# EAGLE board uSlices_v3.1 (EAGLE 9.3.1)
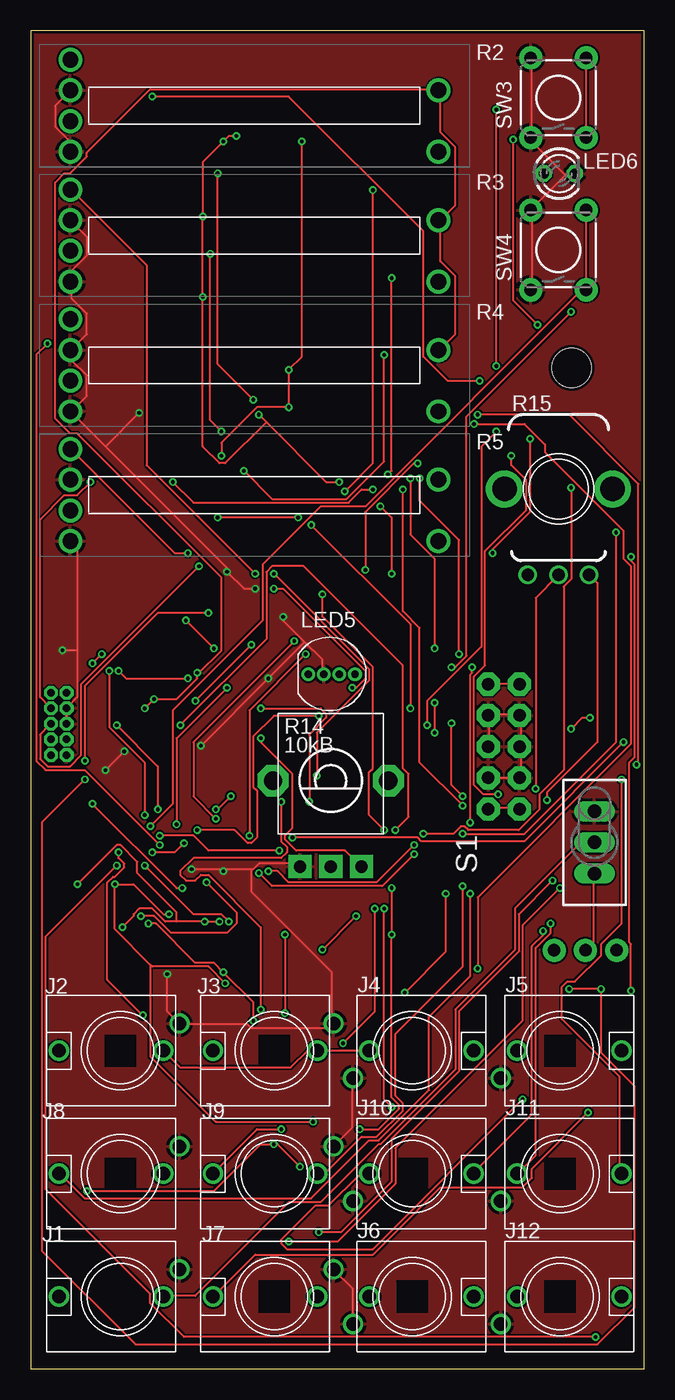
[diagram p3: board, top side]
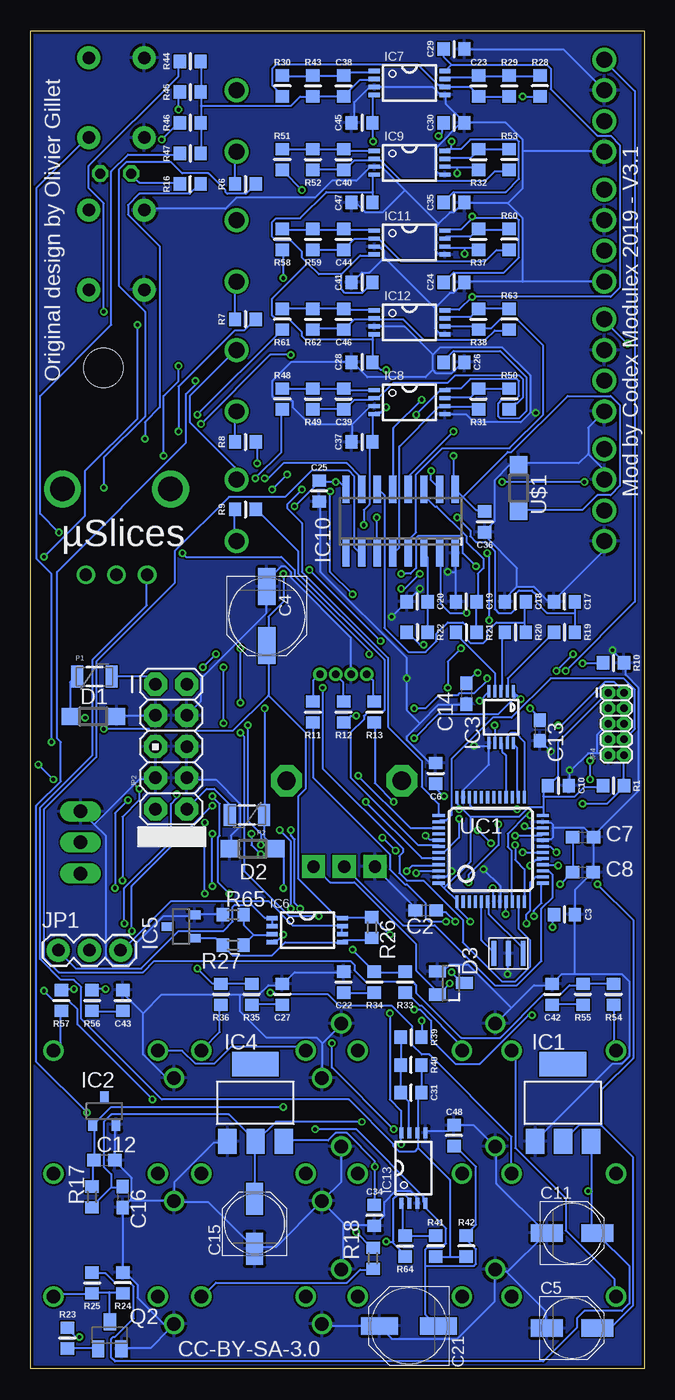
[diagram p4: board, bottom side, seen from below]

Size 50 x 109 mm. Coordinates in mm from the lower left corner, seen from the top.
Outline: 0,0 50,0 50,109 0,109 0,0
Copper layers (1*16): Top 0.035mm / dielectric 1.5mm / Bottom 0.035mm
Design rules "dirt_cheap_dirty_boards.v1.1": minimum track width 6mil, minimum drill 12mil, track to track 6mil, track to pad 6mil, pad to pad 6mil, via to via 6mil, smd to smd 0mil, copper to edge 10mil, drill to drill 10mil, minimum pad ring 10mil, minimum via ring 6mil, stop-mask expansion 2mil, vias tented up to drill 25mil, thermal gap 10mil
Holes 3.2 mm at 44.07,81.53

## Footprints (pad centres in the part's own frame; a part is rotated, then mirrored left to right if it is on the bottom)
C0603 = smd 1.1 x 1: 1 -0.85,0; 2 0.85,0
PARTS_AMAN_RESISTOR_0603 = smd 1 x 1.1: 1 -0.85,0; 2 0.85,0
PANASONIC_D = smd 3 x 1.4: + 2.4,0; - -2.4,0
PANASONIC_C = smd 2.6 x 1.4: + 2.05,0; - -2.05,0
SOD123 = smd 1.4 x 1.4: A 1.9,0; C -1.9,0
SOT23 = smd 1 x 1.4: 1 -0.95,-1.1; 2 0.95,-1.1; 3 0,1.1
SOT223 = smd 1.499 x 2.007: 1 -2.261,-3.15; 2 0.025,-3.15; 3 2.311,-3.15 | smd 3.81 x 2.007: 4 0,3.15
DBZ_R-PDSO-G3 = smd 0.7 x 1: 1 -0.95,-1.1; 2 0.95,-1.1; 3 0,1.1
MSOP10 = smd 0.25 x 1: 1 -1,-2.113; 2 -0.5,-2.113; 3 0,-2.113; 4 0.5,-2.113; 5 1,-2.113; 6 1,2.113; 7 0.5,2.113; 8 0,2.113; 9 -0.5,2.113; 10 -1,2.113
TSSOP-8 = smd 0.9 x 0.35: 1 -2.875,0.975; 2 -2.875,0.325; 3 -2.875,-0.325; 4 -2.875,-0.975; 5 2.875,-0.975; 6 2.875,-0.325; 7 2.875,0.325; 8 2.875,0.975
SOIC16N = smd 0.6 x 2.2: 1 -4.445,-2.6; 2 -3.175,-2.6; 3 -1.905,-2.6; 4 -0.635,-2.6; 5 0.635,-2.6; 6 1.905,-2.6; 7 3.175,-2.6; 8 4.445,-2.6; 9 4.445,2.6; 10 3.175,2.6; 11 1.905,2.6; 12 0.635,2.6; 13 -0.635,2.6; 14 -1.905,2.6; 15 -3.175,2.6; 16 -4.445,2.6
INSTRUO_S_JACK_S2_INV = drill 1.1: GND 2.223,-4.826; NORM 0,-3.5; TIP 0,5
1X03 = drill 1.016 pad 1.88: 1 0,0; 2 2.54,0; 3 5.08,0
AVR_ICSP = drill 1.016 pad 1.88 octagon: 1 -1.27,5.08; 2 1.27,5.08; 3 -1.27,2.54; 4 1.27,2.54; 5 -1.27,0; 6 1.27,0; 7 -1.27,-2.54; 8 1.27,-2.54; 9 -1.27,-5.08; 10 1.27,-5.08
2X5-1.27 = drill 0.61 pad 1.067 octagon: 1 -1.27,3.81; 2 0,3.81; 3 -1.27,2.54; 4 0,2.54; 5 -1.27,1.27; 6 0,1.27; 7 -1.27,0; 8 0,0; 9 -1.27,-1.27; 10 0,-1.27
LED-TRICOLOR-THROUGHHOLE = drill 0.6: BLU 0.635,0; GND -0.635,0; GRN 1.905,0; RED -1.905,0
LED3MM = drill 0.813 octagon: A -1.27,0; K 1.27,0
PTC-1206 = smd 1 x 1.8: 1 -1.4,0; 2 1.4,0
INSTRUO_CRYSTAL_SMALLER = smd 0.4 x 2: GND 0,0; X1 -1.2,0; X2 1.2,0
SOT23-BEC = smd 1 x 1.4: B -0.95,-1.1; C 0,1.1; E 0.95,-1.1
PTL2010G0103B2 = drill 1.3 pad 1.95: 1 2.5,3.75; 2 2.5,1.25; 3 2.5,-1.25; 4 2.5,-3.75; 5 32.5,-3.75; 6 32.5,1.25
ALPS_POT_VERTICAL_PS = drill 1 pad 1.88 square: P$1 -2.5,7; P$2 0,7; P$3 2.5,7 | drill 1.5 pad 2.54 octagon: P$4 -4.7,0; P$5 4.7,0
INSTRUO_Q-POT2 = drill 1 pad 1.5: P$1 -2.5,-7; P$2 0,-7; P$3 2.5,-7 | drill 2 pad 2.5: P$4 -4.4,0; P$5 4.4,0
R0603 = smd 1 x 1.1: 1 -0.85,0; 2 0.85,0
TL3XPO = drill 1.1 pad 1.422 long: 1 -2.54,0; 2 0,0; 3 2.54,0
SPARKFUN_TACTILE-PTH = drill 1.016 pad 1.88: 1 -3.251,2.261; 2 3.251,2.261; 3 -3.251,-2.261; 4 3.251,-2.261
LQFP48 = smd 0.254 x 1: 1 -2.75,-4.25; 2 -2.25,-4.25; 3 -1.75,-4.25; 4 -1.25,-4.25; 5 -0.75,-4.25; 6 -0.25,-4.25; 7 0.25,-4.25; 8 0.75,-4.25; 9 1.25,-4.25; 10 1.75,-4.25; 11 2.25,-4.25; 12 2.75,-4.25; 25 2.75,4.25; 26 2.25,4.25; 27 1.75,4.25; 28 1.25,4.25; 29 0.75,4.25; 30 0.25,4.25; 31 -0.25,4.25; 32 -0.75,4.25; 33 -1.25,4.25; 34 -1.75,4.25; 35 -2.25,4.25; 36 -2.75,4.25 | smd 1 x 0.254: 13 4.25,-2.75; 14 4.25,-2.25; 15 4.25,-1.75; 16 4.25,-1.25; 17 4.25,-0.75; 18 4.25,-0.25; 19 4.25,0.25; 20 4.25,0.75; 21 4.25,1.25; 22 4.25,1.75; 23 4.25,2.25; 24 4.25,2.75; 37 -4.25,2.75; 38 -4.25,2.25; 39 -4.25,1.75; 40 -4.25,1.25; 41 -4.25,0.75; 42 -4.25,0.25; 43 -4.25,-0.25; 44 -4.25,-0.75; 45 -4.25,-1.25; 46 -4.25,-1.75; 47 -4.25,-2.25; 48 -4.25,-2.75

## Placement (x,y rotation side)
C2  100n  [C0603]  17.8,37.34 180 bottom
C3  100n  [PARTS_AMAN_RESISTOR_0603]  6.5,37 0 bottom
C4  47u  [PANASONIC_D]  30.76,61.31 270 bottom
C5  22u  [PANASONIC_C]  5.89,3.32 0 bottom
C6  100n  [PARTS_AMAN_RESISTOR_0603]  17,48.5 90 bottom
C7  100n  [C0603]  5,43.31 0 bottom
C8  3.3u  [C0603]  5.01,40.45 0 bottom
C10  100n  [PARTS_AMAN_RESISTOR_0603]  7,47.5 0 bottom
C11  22u  [PANASONIC_C]  5.88,11.06 0 bottom
C12  470n  [C0603]  44,17 0 bottom
C13  100n  [C0603]  8.5,52 270 bottom
C14  3.3u  [C0603]  14.5,55 270 bottom
C15  22u  [PANASONIC_C]  31.75,11.81 90 bottom
C16  100n  [C0603]  42.5,14 270 bottom
C17  1u  [PARTS_AMAN_RESISTOR_0603]  6.5,62.5 180 bottom
C18  1u  [PARTS_AMAN_RESISTOR_0603]  10.5,62.5 180 bottom
C19  1u  [PARTS_AMAN_RESISTOR_0603]  14.5,62.5 180 bottom
C20  1u  [PARTS_AMAN_RESISTOR_0603]  18.5,62.5 180 bottom
C21  47u  [PANASONIC_D]  19.17,3.49 180 bottom
C22  560p  [PARTS_AMAN_RESISTOR_0603]  24.5,31.5 90 bottom
C23  18p  [PARTS_AMAN_RESISTOR_0603]  13.5,104.5 90 bottom
C24  100n  [PARTS_AMAN_RESISTOR_0603]  15.5,88.5 0 bottom
C25  100n  [PARTS_AMAN_RESISTOR_0603]  26.5,71.5 270 bottom
C26  100n  [PARTS_AMAN_RESISTOR_0603]  15.5,82 0 bottom
C27  560p  [PARTS_AMAN_RESISTOR_0603]  29.5,30.5 90 bottom
C28  100n  [PARTS_AMAN_RESISTOR_0603]  23,82 0 bottom
C29  100n  [PARTS_AMAN_RESISTOR_0603]  15.5,107.5 0 bottom
C30  100n  [PARTS_AMAN_RESISTOR_0603]  15.5,101.5 0 bottom
C31  560p  [PARTS_AMAN_RESISTOR_0603]  19,22.5 180 bottom
C34  100n  [PARTS_AMAN_RESISTOR_0603]  22,12.5 270 bottom
C35  100n  [PARTS_AMAN_RESISTOR_0603]  15.5,95 0 bottom
C36  100n  [PARTS_AMAN_RESISTOR_0603]  13,69 90 bottom
C37  100n  [PARTS_AMAN_RESISTOR_0603]  23,75.5 0 bottom
C38  18p  [PARTS_AMAN_RESISTOR_0603]  24.5,104.5 90 bottom
C39  18p  [PARTS_AMAN_RESISTOR_0603]  24.5,79 90 bottom
C40  18p  [PARTS_AMAN_RESISTOR_0603]  24.5,98.5 90 bottom
C41  100n  [PARTS_AMAN_RESISTOR_0603]  23,88.5 0 bottom
C42  560p  [PARTS_AMAN_RESISTOR_0603]  7.5,30.5 90 bottom
C43  560p  [PARTS_AMAN_RESISTOR_0603]  42.5,30 90 bottom
C44  18p  [PARTS_AMAN_RESISTOR_0603]  24.5,92 90 bottom
C45  100n  [PARTS_AMAN_RESISTOR_0603]  23,101.5 0 bottom
C46  18p  [PARTS_AMAN_RESISTOR_0603]  24.5,85.5 90 bottom
C47  100n  [PARTS_AMAN_RESISTOR_0603]  23,95 0 bottom
C48  100n  [PARTS_AMAN_RESISTOR_0603]  15.5,19 270 bottom
D1  1N5819HW  [SOD123]  44.89,53.14 0 bottom
D2  1N5819HW  [SOD123]  31.91,42.36 0 bottom
D3  BAT54S  [SOT23]  15.76,31.43 270 bottom
IC1  LM1117-3.3  [SOT223]  6.63,21.68 0 bottom
IC2  LM4040B25  [DBZ_R-PDSO-G3]  44,21 0 bottom
IC3  DAC124S085CIMT  [MSOP10]  11.67,53.09 180 bottom
IC4  LM1117-3.3  [SOT223]  31.7,21.68 0 bottom
IC5  LM4040B10  [DBZ_R-PDSO-G3]  37.74,36.02 90 bottom
IC6  TL072TSSOP  [TSSOP-8]  27.45,35.74 0 bottom
IC7  TL072TSSOP  [TSSOP-8]  19.13,104.74 0 bottom
IC8  TL072TSSOP  [TSSOP-8]  19.13,78.74 0 bottom
IC9  TL072TSSOP  [TSSOP-8]  19.13,98.24 0 bottom
IC10  V2164SZ  [SOIC16N]  19.86,69.04 0 bottom
IC11  TL072TSSOP  [TSSOP-8]  19.13,91.74 0 bottom
IC12  TL072TSSOP  [TSSOP-8]  19.13,85.24 0 bottom
IC13  TL072TSSOP  [TSSOP-8]  18.81,16.36 90 bottom
J1  [INSTRUO_S_JACK_S2_INV]  7.31,5.88 90 top
J2  [INSTRUO_S_JACK_S2_INV]  7.31,25.91 90 top
J3  [INSTRUO_S_JACK_S2_INV]  19.86,25.91 90 top
J4  [INSTRUO_S_JACK_S2_INV]  31.09,25.91 270 top
J5  [INSTRUO_S_JACK_S2_INV]  43.14,25.91 270 top
J6  [INSTRUO_S_JACK_S2_INV]  31.09,5.88 270 top
J7  [INSTRUO_S_JACK_S2_INV]  19.86,5.88 90 top
J8  [INSTRUO_S_JACK_S2_INV]  7.31,15.89 90 top
J9  [INSTRUO_S_JACK_S2_INV]  19.86,15.89 90 top
J10  [INSTRUO_S_JACK_S2_INV]  31.09,15.89 270 top
J11  [INSTRUO_S_JACK_S2_INV]  43.14,15.89 270 top
J12  [INSTRUO_S_JACK_S2_INV]  43.14,5.88 270 top
JP1  [1X03]  47.75,34.09 0 bottom
JP2  M05X2PTH  [AVR_ICSP]  38.56,50.68 0 bottom
JP4  M05X2MINIJTAG  [2X5-1.27]  1.66,51.27 0 bottom
LED5  WP154A4SUREQBFZG  [LED-TRICOLOR-THROUGHHOLE]  24.52,56.58 0 top
LED6  [LED3MM]  43.07,97.37 0 top
P1  PTCSMD  [PTC-1206]  44.8,56.39 0 bottom
P2  PTCSMD  [PTC-1206]  32.38,45.11 180 bottom
Q1  8MHz  [INSTRUO_CRYSTAL_SMALLER]  11.07,33.84 0 bottom
Q2  MMBT3904  [SOT23-BEC]  43.55,2.74 0 bottom
R1  10k  [PARTS_AMAN_RESISTOR_0603]  2.5,47.5 180 bottom
R2  PTL20-10G0-103B2  [PTL2010G0103B2]  0.74,102.89 0 top
R3  PTL20-10G0-103B2  [PTL2010G0103B2]  0.74,92.32 0 top
R4  PTL20-10G0-103B2  [PTL2010G0103B2]  0.74,81.74 0 top
R5  PTL20-10G0-103B2  [PTL2010G0103B2]  0.74,71.17 0 top
R6  100  [PARTS_AMAN_RESISTOR_0603]  32.5,96.5 0 bottom
R7  100  [PARTS_AMAN_RESISTOR_0603]  32.5,85.5 0 bottom
R8  100  [PARTS_AMAN_RESISTOR_0603]  32.5,75.5 0 bottom
R9  100  [PARTS_AMAN_RESISTOR_0603]  32.5,70 0 bottom
R10  10k  [PARTS_AMAN_RESISTOR_0603]  2.5,57.5 180 bottom
R11  100  [PARTS_AMAN_RESISTOR_0603]  27,53.5 90 bottom
R12  100  [PARTS_AMAN_RESISTOR_0603]  24.5,53.5 90 bottom
R13  100  [PARTS_AMAN_RESISTOR_0603]  22,53.5 90 bottom
R14  10kB  [ALPS_POT_VERTICAL_PS]  24.45,47.91 180 top
R15  10kB CD  [INSTRUO_Q-POT2]  43.01,71.67 0 top
R16  100  [PARTS_AMAN_RESISTOR_0603]  37,96.5 180 bottom
R17  510  [R0603]  45,14 90 bottom
R18  100k  [R0603]  22.1,9 90 bottom
R19  100  [PARTS_AMAN_RESISTOR_0603]  6.5,60 0 bottom
R20  100  [PARTS_AMAN_RESISTOR_0603]  10.5,60 0 bottom
R21  100  [PARTS_AMAN_RESISTOR_0603]  14.5,60 0 bottom
R22  100  [PARTS_AMAN_RESISTOR_0603]  18.5,60 0 bottom
R23  10k  [PARTS_AMAN_RESISTOR_0603]  47,2.5 270 bottom
R24  3.3k  [PARTS_AMAN_RESISTOR_0603]  42.5,7 270 bottom
R25  4.7k  [PARTS_AMAN_RESISTOR_0603]  45,7 90 bottom
R26  4.7k  [R0603]  22.19,35.95 270 bottom
R27  100k  [R0603]  33.5,34.5 180 bottom
R28  1k  [PARTS_AMAN_RESISTOR_0603]  8.5,104.5 270 bottom
R29  100k  [PARTS_AMAN_RESISTOR_0603]  11,104.5 90 bottom
R30  100k  [PARTS_AMAN_RESISTOR_0603]  29.5,104.5 270 bottom
R31  100k  [PARTS_AMAN_RESISTOR_0603]  13.5,79 90 bottom
R32  100k  [PARTS_AMAN_RESISTOR_0603]  13.5,98.5 90 bottom
R33  100k  [PARTS_AMAN_RESISTOR_0603]  19.5,31.5 90 bottom
R34  510  [PARTS_AMAN_RESISTOR_0603]  22,31.5 90 bottom
R35  510  [PARTS_AMAN_RESISTOR_0603]  32,30.5 90 bottom
R36  100k  [PARTS_AMAN_RESISTOR_0603]  34.5,30.5 90 bottom
R37  100k  [PARTS_AMAN_RESISTOR_0603]  13.5,92 90 bottom
R38  100k  [PARTS_AMAN_RESISTOR_0603]  13.5,85.5 90 bottom
R39  1k  [PARTS_AMAN_RESISTOR_0603]  19,27 0 bottom
R40  33k  [PARTS_AMAN_RESISTOR_0603]  19,24.75 180 bottom
R41  100k  [PARTS_AMAN_RESISTOR_0603]  17,10 270 bottom
R42  240k  [PARTS_AMAN_RESISTOR_0603]  14.5,10 270 bottom
R43  49.9k  [PARTS_AMAN_RESISTOR_0603]  27,104.5 90 bottom
R44  100k  [PARTS_AMAN_RESISTOR_0603]  37,106.5 0 bottom
R45  100k  [PARTS_AMAN_RESISTOR_0603]  37,104 0 bottom
R46  100k  [PARTS_AMAN_RESISTOR_0603]  37,101.5 0 bottom
R47  100k  [PARTS_AMAN_RESISTOR_0603]  37,99 0 bottom
R48  1k  [PARTS_AMAN_RESISTOR_0603]  29.5,79 270 bottom
R49  100k  [PARTS_AMAN_RESISTOR_0603]  27,79 90 bottom
R50  100k  [PARTS_AMAN_RESISTOR_0603]  11,79 270 bottom
R51  1k  [PARTS_AMAN_RESISTOR_0603]  29.5,98.5 270 bottom
R52  100k  [PARTS_AMAN_RESISTOR_0603]  27,98.5 90 bottom
R53  100k  [PARTS_AMAN_RESISTOR_0603]  11,98.5 270 bottom
R54  100k  [PARTS_AMAN_RESISTOR_0603]  2.5,30.5 90 bottom
R55  510  [PARTS_AMAN_RESISTOR_0603]  5,30.5 90 bottom
R56  510  [PARTS_AMAN_RESISTOR_0603]  45,30 90 bottom
R57  100k  [PARTS_AMAN_RESISTOR_0603]  47.5,30 90 bottom
R58  1k  [PARTS_AMAN_RESISTOR_0603]  29.5,92 270 bottom
R59  100k  [PARTS_AMAN_RESISTOR_0603]  27,92 90 bottom
R60  100k  [PARTS_AMAN_RESISTOR_0603]  11,92 270 bottom
R61  1k  [PARTS_AMAN_RESISTOR_0603]  29.5,85.5 270 bottom
R62  100k  [PARTS_AMAN_RESISTOR_0603]  27,85.5 90 bottom
R63  100k  [PARTS_AMAN_RESISTOR_0603]  11,85.5 270 bottom
R64  100k  [PARTS_AMAN_RESISTOR_0603]  19.5,10 90 bottom
R65  100k  [R0603]  33.5,37 0 bottom
S1  TL32PO  [TL3XPO]  45.94,42.88 270 top
SW3  [SPARKFUN_TACTILE-PTH]  43.01,103.54 90 top
SW4  [SPARKFUN_TACTILE-PTH]  43.01,91.14 90 top
U$1  1N5819HW  [SOD123]  10.25,71.75 270 bottom
UC1  STM32F103CBT6  [LQFP48]  12.51,42.31 0 bottom

## Tracks (layer width: path | path; a pad name or v marks a point on that pad's centre or on a via)
+3V3  (via drill 0.3)
  Top 0.152: v7.47,35.97 8.38,36.88 8.38,37.03 8.84,37.49 9.91,37.49 10.97,36.42 11.89,36.42 | 11.89,36.42 v14.17,36.42 v15.39,36.42 | v16.31,46.63 15.24,45.57 v15.09,45.57 | v3.81,39.47 7.01,42.67 7.32,42.67 8.69,41.3 8.69,40.39 11.89,37.19 11.89,36.42
  Bottom 0.152: 3.5,19.81 5.33,19.81 6.55,18.59 IC1.2 | 3.5,19.81 0.91,17.22 0.91,5.18 2.74,3.35 3.81,3.35 C5.+ | 16.31,39.17 16.61,39.47 UC1.48 | 16.31,39.17 15.24,38.1 UC1.1 15.24,37.95 15.24,37.49 v14.17,36.42 | v7.47,35.97 7.47,36.88 C3.1 | v15.39,36.42 16.15,37.19 16.92,37.19 C2.1 | 8.23,46.63 8.23,47.09 7.92,47.4 C10.1 7.77,47.55 7.01,48.31 7.01,51.05 3.05,55.02 JP4.1 | 8.23,46.63 8.23,45.72 | 8.23,45.72 8.23,45.11 UC1.24 | 14.17,44.96 14.94,45.72 | 14.94,45.72 15.24,46.02 15.24,46.48 UC1.36 | 14.17,44.96 10.21,44.96 9.45,45.72 8.23,45.72 | 8.23,46.63 5.64,46.63 4.88,47.4 3.35,47.4 R1.2 | v16.31,46.63 16.92,47.24 16.92,47.55 C6.1 | 14.94,45.72 v15.09,45.57 | 16.31,39.17 14.17,41.3 14.17,44.96 | 3.5,19.81 3.5,22.71 0.91,25.3 0.91,36.58 v3.81,39.47
+3V3_A  (via drill 0.3)
  Top 0.152: R4.6 33.38,83.06 34.59,84.28 34.59,89 33.38,90.22 33.38,93.42 R3.6 33.38,93.57 34.59,94.79 34.59,99.52 33.38,100.74 33.38,104.09 R2.6 33.22,104.24 9.75,104.24 4.57,99.06 4.57,98.75 3.2,97.38 2.74,97.38 1.98,96.62 1.98,77.42 3.2,76.2 3.81,76.2 15.54,64.47 15.54,58.52 13.56,56.54 | v11.28,37.03 10.82,37.03 8.38,39.47 v6.86,39.47 6.86,35.81 9.75,32.92 | v9.3,53.8 v10.06,54.56 11.89,54.56 13.56,56.24 13.56,56.54 | v18.75,51.36 18.75,51.05 21.34,48.46 21.34,44.04 20.73,43.43 20.73,43.13 21.64,42.22 25.6,42.22 26.82,41 R14.P$1 | 9.75,32.92 9.91,32.77 14.48,32.77 v15.85,31.39 | v23.01,20.12 15.09,20.12 9.75,25.45 9.75,32.92 | 13.56,56.54 v13.56,56.69
  Bottom 0.152: R5.6 33.38,72.54 33.38,73.46 37.03,77.11 37.03,79.25 33.38,82.91 R4.6 | 43.43,14.78 42.52,14.78 C16.1 | 43.43,14.78 44.96,13.26 R17.1 | IC4.2 31.7,18.44 31.7,13.87 C15.+ | 43.43,14.78 43.43,15.85 44.04,16.46 44.04,20.12 43.43,20.73 33.83,20.73 31.7,18.59 IC4.2 | v11.28,37.03 11.28,37.95 UC1.9 | v6.86,39.47 5.94,40.39 C8.1 5.79,40.54 5.79,43.28 C7.1 | v10.06,54.56 10.36,54.86 | 10.36,54.86 10.67,55.17 IC3.1 | v9.3,53.8 8.38,52.88 C13.1 | v13.56,56.69 13.72,56.69 14.48,55.93 C14.1 | R14.P$1 26.82,40.84 25.6,39.62 23.62,39.62 18.59,34.59 18.59,32.46 16.92,30.79 16.92,30.48 D3.2 16.76,30.48 v15.85,31.39 | 10.36,54.86 11.89,53.34 16.76,53.34 v18.75,51.36 | v23.01,20.12 30.02,20.12 31.55,18.59 IC4.2
ADD_SWITCH  (via drill 0.3)
  Top 0.152: v10.52,43.43 13.26,43.43 14.48,42.22 v20.27,42.22 | v21.34,43.28 31.55,43.28 31.85,42.98 40.23,42.98 v48.31,51.05 | SW3.4 45.26,106.68 45.26,100.43 SW3.3
  Bottom 0.152: v10.52,43.43 8.38,43.43 UC1.21 | v21.34,43.28 v20.27,42.22 | v48.31,51.05 48.31,64.77 49.53,65.99 49.53,96.16 45.41,100.28 SW3.3
AREF_2.5  (via drill 0.3)
  Top 0.152: v12.19,52.43 19.2,59.44 19.2,64.92 19.66,65.38 22.25,65.38 30.33,57.3 30.33,48.92 30.79,48.46 30.79,44.96 v29.72,43.89 | v28.8,37.49 28.8,21.95 v29.41,21.34
  Bottom 0.152: R17.2 44.96,14.94 44.96,16.92 C12.1 44.81,17.07 44.81,19.81 IC2.1 44.81,19.96 43.43,21.34 v29.41,21.34 | v12.19,52.43 12.19,51.05 IC3.7 | v29.72,43.89 28.8,42.98 v28.8,37.49
AREF_5
  Bottom 0.152: IC6.2 30.33,36.12 30.33,36.58 IC6.1 30.94,36.73 32,37.8 33.38,37.8 33.53,37.64 33.53,36.42 34.29,35.66 37.95,35.66 41,32.61 46.33,32.61 47.7,33.98 JP1.1
AREF_10
  Bottom 0.152: IC6.6 24.69,35.51 24.69,35.97 IC6.7 24.69,36.12 28.65,36.12 30.63,38.1 38.56,38.1 42.52,34.14 JP1.3
AREF_10_0
  Bottom 0.152: R26.2 22.25,35.05 22.4,34.9 24.54,34.9 IC6.5 24.69,34.75 29.26,34.75 30.33,33.68 33.53,33.68 34.29,34.44 R27.2 34.44,34.59 34.9,35.05 36.58,35.05 IC5.1
BOOT_FLASH  (via drill 0.3)
  Top 0.152: v22.71,46.18 22.71,51.66 24.08,53.03 24.08,53.34 23.62,53.8 v18.75,53.8 | v12.8,56.24 7.77,56.24 v7.16,56.84 | v5.03,57.45 v5.79,58.22
  Bottom 0.152: v22.71,46.18 18.14,41.6 16.76,41.6 UC1.44 | v18.75,53.8 17.83,53.8 16.76,54.86 15.24,54.86 15.09,55.02 13.87,55.02 12.8,56.08 v12.8,56.24 | v5.79,58.22 v7.16,56.84 | v5.03,57.45 3.35,57.45 R10.2
DAC_MOSI
  Bottom 0.152: UC1.28 11.28,46.63 11.28,49.99 11.58,50.29 11.58,50.9 IC3.8
DAC_SCK
  Bottom 0.152: UC1.26 10.36,46.63 10.36,50.6 10.67,50.9 IC3.10
DAC_SS
  Bottom 0.152: UC1.25 9.75,46.63 9.75,51.05 10.52,51.82 10.82,51.82 11.12,51.51 11.12,51.05 IC3.9
DEL_SWITCH  (via drill 0.3)
  Top 0.152: v9.75,44.2 11.58,46.02 11.58,53.65 18.9,60.96 18.9,65.53 23.62,70.26 27.28,70.26 44.81,87.78 45.26,87.78 SW4.3 45.26,87.94 45.26,94.34 SW4.4
  Bottom 0.152: v9.75,44.2 9.6,44.04 8.38,44.04 UC1.22
FB_CURRENT
  Bottom 0.152: R54.2 2.59,31.39 4.88,31.39 R55.2 5.03,31.24 6.1,31.24 6.86,30.48 8.23,30.48 11.73,26.98 14.94,26.98 18.59,30.63 18.59,31.24 18.9,31.55 22.71,31.55 23.62,32.46 23.62,32.92 23.93,33.22 39.93,33.22 40.84,32.31 47.7,32.31 48.92,33.53 48.92,45.57 44.65,49.84 44.65,57.61 38.25,64.01 38.25,66.6 33.83,71.02 29.26,71.02 27.13,73.15 24.08,73.15 23.62,72.69 23.62,66.9 23.16,66.45 IC10.2
FB_CURRENT1  (via drill 0.3)
  Top 0.152: v26.52,36.88 v23.77,34.14 | v32.92,54.25 v32.92,51.82 | v32.92,58.67 32.92,65.99 30.94,67.97 v30.94,72.54
  Bottom 0.152: R33.2 19.51,32.31 21.95,32.31 R34.2 22.1,32.46 v23.77,34.14 | v26.52,36.88 28.96,36.88 32.61,40.54 32.61,51.51 v32.92,51.82 | v32.92,58.67 v32.92,54.25 | v30.94,72.54 30.63,72.54 29.41,73.76 24.23,73.76 23.16,72.69 23.16,71.78 IC10.15
FB_CURRENT2  (via drill 0.3)
  Top 0.152: v36.42,32.61 36.42,38.41 48.92,50.9 48.92,65.38 48.31,65.99 48.31,68.28 41.91,74.68 41.91,75.29 40.23,76.96 v36.12,76.96 | v28.8,82.6 28.8,73.91 25.76,70.87 19.66,70.87 v17.37,73.15
  Bottom 0.152: R35.2 32,31.39 34.44,31.39 R36.2 34.59,31.39 35.2,31.39 v36.42,32.61 | v36.12,76.96 30.48,82.6 v28.8,82.6 | v17.37,73.15 17.37,72.39 16.76,71.78 IC10.10
FB_CURRENT3  (via drill 0.3)
  Top 0.152: v43.89,30.94 v46.48,30.94 46.48,25.76 49.23,23.01 49.23,5.03 46.18,1.98 8.53,1.98 0.91,9.6 0.91,44.5 v4.42,48.01 | v4.42,49.53 4.42,55.63 10.36,61.57 v14.48,61.57
  Bottom 0.152: v43.89,30.94 44.96,30.94 R56.2 | v46.48,30.94 47.4,30.94 R57.2 | v4.42,49.53 v4.42,48.01 | v14.48,61.57 15.85,61.57 16.61,62.33 16.61,66.29 IC10.7
FRAME_CHANGE  (via drill 0.3)
  Top 0.152: v7.01,41 1.22,35.2 1.22,14.63 9.75,6.1 9.75,5.33 12.5,2.59 v46.02,2.59
  Bottom 0.152: v7.01,41 8.23,41 UC1.16 | v46.02,2.59 46.33,2.59 46.94,3.2 R23.1
GAIN_1  (via drill 0.3)
  Top 0.152: v21.79,69.34 v15.24,69.34
  Bottom 0.152: 5.64,61.57 5.64,62.48 C17.1 | 5.64,61.57 5.64,60.05 R19.2 | 5.64,61.57 7.92,61.57 8.84,62.48 8.84,63.09 9.14,63.4 10.21,63.4 10.52,63.09 10.52,61.87 10.82,61.57 11.89,61.57 12.19,61.87 12.19,66.6 12.95,67.36 13.72,67.36 14.17,67.82 14.17,68.28 v15.24,69.34 | v21.79,69.34 21.79,66.45 IC10.3
GAIN_2
  Bottom 0.152: 9.75,60.81 9.75,62.48 C18.1 | 9.75,60.81 9.75,60.05 R20.2 | 9.75,60.81 12.04,60.81 12.8,60.05 12.8,59.44 13.11,59.13 14.17,59.13 14.48,59.44 14.48,60.5 14.78,60.81 16,60.81 16.92,59.89 16.92,59.28 17.83,58.37 19.2,58.37 21.18,60.35 21.18,71.17 21.64,71.63 IC10.14
GAIN_3
  Bottom 0.152: R21.2 13.72,60.05 13.72,62.48 C19.1 13.56,62.64 13.56,64.77 13.11,65.23 13.11,65.99 14.48,67.36 14.48,67.82 16.92,70.26 17.07,70.26 17.83,71.02 17.83,71.63 IC10.11
GAIN_4
  Bottom 0.152: R22.2 17.68,60.05 17.68,62.48 C20.1 17.68,62.64 17.68,66.14 17.83,66.29 IC10.6
GND  (via drill 0.3)
  Top 0.152: v11.12,32.16 11.12,29.11 12.04,28.19 J2.GND 12.19,28.04 17.68,28.04 17.98,27.74 24.23,27.74 24.54,28.04 J3.GND 24.54,28.19 24.54,32.31 17.98,38.86 17.98,40.69 | 17.98,40.69 18.14,40.69 18.59,41.15 21.79,41.15 21.95,41 R14.P$3 | 17.98,40.69 15.7,40.69 | 15.7,40.69 v13.11,40.69 | 15.7,40.69 v15.7,40.54 | J6.GND 26.21,3.66 26.21,6.55 24.69,8.08 J7.GND | J4.GND 26.21,23.62 26.21,19.66 24.69,18.14 J9.GND | v20.57,61.27 20.57,60.96 22.25,59.28 | 22.25,59.28 23.77,57.76 23.77,56.69 LED5.GND | v13.87,50.75 v19.36,56.24 22.25,59.13 22.25,59.28 | JP2.8 37.34,48.16 39.78,48.16 JP2.7 39.93,48.16 39.93,50.6 JP2.5 39.93,50.75 39.93,53.19 JP2.3 39.78,53.34 37.34,53.34 JP2.4 37.34,53.19 37.34,50.75 JP2.6 | JP4.5 2.9,52.58 2.9,53.8 JP4.3 3.05,53.95 3.81,54.71 3.81,58.52 | v6.1,48.77 v7.62,50.29 | 3.81,58.52 3.81,66.9 3.35,67.36 R5.4 | 43.59,97.23 44.2,97.23 LED6.K | 43.59,97.23 40.84,94.49 SW4.2 40.84,94.34 40.84,87.94 SW4.1 | 43.59,97.23 40.84,99.97 40.84,100.28 SW3.1 40.84,100.43 40.84,106.68 SW3.2 | R2.4 3.2,99.21 3.2,99.97 1.98,101.19 1.98,102.87 3.2,104.09 R2.2 | R3.2 3.35,93.42 4.57,92.2 4.57,90.68 3.35,89.46 3.35,88.7 R3.4 3.35,88.54 3.35,87.17 4.57,85.95 4.57,84.28 3.35,83.06 R4.2 3.35,82.91 3.35,82.14 4.57,80.92 4.57,79.25 3.35,78.03 R4.4 3.35,77.88 6.1,75.13 | 6.1,75.13 16,65.23 v16,64.92 17.37,63.55 v18.29,63.55 | 6.1,75.13 v8.84,77.88 | 3.81,58.52 v2.59,58.52
  Bottom 0.152: 7.47,44.04 7.47,44.35 7.62,44.5 8.23,44.5 UC1.23 | 7.47,44.04 7.47,43.28 7.62,43.13 8.23,43.13 UC1.20 | C7.2 4.12,43.28 4.12,40.54 C8.2 4.27,40.39 5.64,39.01 5.64,37.03 C3.2 5.64,36.88 5.64,32.16 | C7.2 4.12,43.43 0.46,47.09 0.46,55.47 1.52,56.54 1.52,57.45 R10.1 1.68,57.61 v2.59,58.52 | 7.47,44.04 4.88,44.04 4.27,43.43 C7.2 | 10.82,29.41 12.04,28.19 J2.GND | 10.82,29.41 8.99,31.24 7.62,31.24 C42.2 7.47,31.39 6.71,32.16 5.64,32.16 | 10.82,29.41 14.33,32.92 15.85,32.92 16.31,32.46 16.76,32.46 D3.1 | v11.12,32.16 11.12,33.83 Q1.GND | 5.64,32.16 1.83,32.16 1.22,31.55 1.22,25.45 1.83,24.84 2.59,24.84 8.84,18.59 IC1.1 | IC13.5 17.83,19.36 16,19.36 15.54,19.81 C48.1 15.39,19.81 13.87,19.81 12.19,18.14 J8.GND 12.04,17.98 12.04,15.09 8.08,11.12 C11.- 8.08,10.97 11.12,7.92 11.28,7.92 | 11.28,7.92 11.43,8.08 12.04,8.08 J1.GND 12.19,8.08 12.19,5.49 15.24,2.44 20.57,2.44 21.49,3.35 C21.+ 21.64,3.5 26.21,3.5 J6.GND | 11.28,7.92 8.08,4.72 8.08,3.35 C5.- | C22.2 24.54,32.31 28.5,32.31 29.41,31.39 C27.2 29.57,31.24 30.63,31.24 31.39,30.48 32.92,30.48 | 40.84,28.96 42.37,30.48 42.37,30.79 C43.2 | 40.84,28.96 40.84,25.6 39.01,23.77 38.41,23.77 J5.GND | 32.92,30.48 39.32,30.48 40.84,28.96 | IC4.1 33.98,18.44 35.05,18.44 38.25,15.24 38.25,13.72 J11.GND | 38.71,3.2 38.41,3.5 J12.GND 38.71,3.2 | 38.71,3.2 40.23,1.68 42.52,1.68 Q2.E | IC2.2 43.13,19.81 43.13,17.07 C12.2 43.13,16.92 41.76,15.54 41.76,13.87 41.91,13.72 | 41.91,13.72 42.37,13.26 C16.2 42.52,13.11 42.52,7.92 R24.1 42.37,7.92 41.3,6.86 41.3,5.79 38.71,3.2 | 41.91,13.72 38.41,13.72 J11.GND | v13.11,40.69 11.73,39.32 11.73,38.1 UC1.8
  Bottom 0.152: v15.7,40.54 16.15,40.08 16.61,40.08 UC1.47 | C2.2 18.75,37.34 18.75,37.64 21.95,40.84 R14.P$3 | 26.21,26.52 24.69,28.04 J3.GND | 26.21,26.52 26.21,23.77 J4.GND | IC13.3 18.59,13.56 18.59,14.02 19.05,14.48 20.27,14.48 21.18,13.56 21.18,12.5 21.95,11.73 C34.2 22.1,11.73 24.38,11.73 24.54,11.89 | J10.GND 26.36,13.56 30.02,9.91 31.7,9.91 C15.- 31.85,9.91 35.51,13.56 38.25,13.56 J11.GND | 24.54,11.89 26.21,13.56 J10.GND | 24.54,11.89 24.54,8.23 J7.GND | J9.GND 24.69,17.98 24.69,15.24 26.21,13.72 J10.GND | 32.92,30.48 32.92,29.11 30.79,26.98 26.67,26.98 26.21,26.52 | 18.29,52.58 19.36,51.51 19.36,51.21 17.53,49.38 17.07,49.38 C6.2 | 18.29,52.58 16.76,54.1 14.63,54.1 C14.2 | 18.29,52.58 19.36,53.65 v19.36,56.24 19.36,57.91 26.36,64.92 26.36,70.56 C25.2 | 12.65,50.75 12.65,49.23 14.78,47.09 14.78,46.63 UC1.35 | 12.65,50.75 12.65,50.9 IC3.6 12.65,50.75 | v20.57,61.27 19.36,62.48 C20.2 19.2,62.64 v18.29,63.55 | v13.87,50.75 12.65,50.75 | R65.1 34.44,37.03 36.58,37.03 IC5.2 36.73,36.88 39.17,36.88 41.45,34.59 41.45,33.53 42.06,32.92 43.28,32.92 43.89,33.53 43.89,43.43 44.81,44.35 | 44.81,44.35 45.87,45.41 S1.1 | D2.C 33.68,42.37 33.68,43.43 32.92,44.2 32.92,46.02 34.9,48.01 37.19,48.01 JP2.8 | D1.A 42.98,53.19 39.93,53.19 JP2.3 | JP2.4 37.19,53.34 36.12,54.41 36.12,56.24 30.79,61.57 30.79,63.7 C4.- 30.63,63.86 30.63,64.31 29.57,65.38 29.26,65.38 28.8,64.92 28.8,64.47 23.93,59.59 23.93,56.69 LED5.GND | 44.81,44.35 41.15,48.01 39.93,48.01 JP2.7 | 5.94,48.77 4.57,50.14 3.81,50.14 | 5.94,48.77 6.1,48.62 6.1,47.55 C10.2 | 3.81,50.14 3.05,50.14 JP4.9 | v7.62,50.29 8.38,51.05 C13.2
  Bottom 0.152: 5.94,48.77 v6.1,48.77 | 3.81,50.14 3.81,51.66 3.05,52.43 JP4.5 | 10.36,63.7 8.99,63.7 7.92,62.64 7.47,62.64 C17.2 7.32,62.64 3.35,66.6 3.35,67.36 R5.4 | 10.36,63.7 11.43,62.64 C18.2 | 10.36,63.7 10.36,65.23 12.95,67.82 12.95,68.12 C36.1 12.95,68.28 12.19,69.04 12.19,72.39 10.97,73.61 10.36,73.61 U$1.C 10.21,73.76 5.33,73.76 4.57,74.52 | 23.77,76.96 22.4,78.33 22.1,78.33 IC8.3 | 23.77,76.96 23.77,75.59 C37.1 | 9.3,77.88 10.06,77.11 13.87,77.11 14.48,77.72 16.15,77.72 IC8.5 | 9.3,77.88 9.3,80.92 11.58,83.21 16.61,83.21 17.22,82.6 | 17.22,81.38 17.22,82.6 | 17.22,81.38 16.92,81.08 15.7,81.08 14.78,81.99 C26.2 | 17.22,82.6 19.51,84.89 21.95,84.89 IC12.3 | 17.22,81.38 17.83,80.77 22.55,80.77 23.77,81.99 C28.1 23.93,81.99 28.8,81.99 30.33,80.47 30.33,79.25 30.18,79.1 28.96,79.1 28.65,78.79 28.65,78.33 27.28,76.96 23.77,76.96 | C29.2 14.63,107.44 6.55,107.44 3.35,104.24 R2.2 | C45.1 23.77,101.65 23.62,101.8 23.62,103.17 22.4,104.39 22.1,104.39 IC7.3 21.95,104.39 17.22,104.39 16.61,103.78 16.31,103.78 IC7.5 16.15,103.63 16.15,103.02 14.78,101.65 | 14.78,101.65 17.07,99.36 17.07,97.69 16.76,97.38 16.31,97.38 IC9.5 | 14.78,101.65 C30.2 14.63,101.5 11.28,101.5 9.91,100.13 9.91,99.21 | 16.76,93.27 15.85,94.18 15.54,94.18 14.78,94.94 C35.2 14.63,94.94 11.12,94.94 | 16.76,93.27 17.07,92.96 17.07,91.14 16.76,90.83 16.31,90.83 IC11.5 | 16.76,93.27 19.51,96.01 | 19.51,96.01 21.34,97.84 21.95,97.84 IC9.3 22.1,97.84 22.4,97.84 23.47,96.77 25.45,96.77 26.82,95.4 33.22,95.4 34.14,94.49 40.69,94.49 SW4.2 | 19.51,96.01 21.34,94.18 22.71,94.18 23.47,94.94 23.77,94.94 C47.1
  Bottom 0.152: 21.18,90.53 21.18,90.98 21.49,91.29 21.95,91.29 IC11.3 | 21.18,90.53 22.4,89.31 23.01,89.31 23.77,88.54 C41.1 | 17.07,86.41 17.07,84.73 16.61,84.28 16.31,84.28 IC12.5 | 17.07,86.41 15.85,87.63 15.54,87.63 14.78,88.39 C24.2 14.63,88.54 9.91,88.54 | 17.07,86.41 21.18,90.53 | 15.39,64.92 15.39,66.29 IC10.8 | 15.39,64.92 15.39,62.64 C19.2 | v16,64.92 15.39,64.92 | 4.57,74.52 3.35,73.3 3.35,72.54 R5.2 | 4.57,74.52 4.57,76.66 3.35,77.88 R4.4 | 9.91,88.54 3.35,88.54 R3.4 | 11.12,94.94 9.91,93.73 9.91,88.54 | 9.91,99.21 9.91,96.16 11.12,94.94 | 9.91,99.21 3.35,99.21 R2.4 | v8.84,77.88 9.3,77.88
  pour Top (isolate 0.012): 50,109 0,109 0,0 50,0
  pour Bottom (isolate 0.012): 50,109 0,109 0,0 50,0
IN_1
  Bottom 0.152: R54.1 2.44,29.57 2.44,26.06 J2.TIP
IN_2
  Bottom 0.152: R33.1 19.36,30.63 18.29,29.57 18.14,29.57 14.94,26.36 14.94,26.06 J3.TIP
IN_3
  Bottom 0.152: R36.1 34.59,29.57 34.59,27.43 35.97,26.06 J4.TIP
IN_4
  Bottom 0.152: R57.1 47.55,29.11 47.55,26.52 48.01,26.06 J5.TIP
JTCK  (via drill 0.3)
  Top 0.152: v27.89,71.63 26.98,71.63 25.91,70.56 13.26,70.56 v11.58,72.24 | v4.88,72.24 3.81,71.17 2.74,71.17 0.76,69.19 0.76,54.71 1.52,53.95 JP4.4
  Bottom 0.152: v27.89,71.63 29.11,70.41 29.11,70.1 27.89,68.89 27.89,64.92 20.88,57.91 20.88,52.27 18.14,49.53 18.14,47.4 16.76,46.02 16.76,45.11 UC1.37 | v4.88,72.24 v11.58,72.24
JTDI
  Bottom 0.152: UC1.38 16.61,44.65 16.15,44.65 15.7,45.11 15.7,49.68 12.34,53.03 10.82,53.03 7.62,56.24 1.68,56.24 0.76,55.32 0.76,52.12 1.52,51.36 JP4.8
JTDO  (via drill 0.3)
  Top 0.152: v23.32,48.31 23.32,51.82 27.58,56.08 27.58,57 v19.81,64.77 | v13.72,65.38 4.12,55.78 4.12,49.99 3.2,49.07 1.37,49.07 0.76,49.68 0.76,51.66 1.52,52.43 JP4.6
  Bottom 0.152: v23.32,48.31 19.05,44.04 16.76,44.04 UC1.39 | v19.81,64.77 19.05,64.77 18.59,65.23 18.59,67.67 18.44,67.82 14.94,67.82 14.78,67.67 14.78,66.45 v13.72,65.38
JTMS  (via drill 0.3)
  Top 0.152: v10.36,45.57 10.36,49.07 v7.01,52.43
  Bottom 0.152: v10.36,45.57 13.87,45.57 14.17,45.87 14.17,46.48 UC1.34 | v7.01,52.43 6.71,52.43 3.2,55.93 2.44,55.93 1.68,55.17 JP4.2
LED_B  (via drill 0.3)
  Top 0.152: v9.91,42.06 11.73,42.06 v12.5,42.82 | v13.56,43.89 16.61,43.89 17.68,42.82 17.98,42.82 18.44,43.28 18.44,47.09 18.14,47.4 18.14,51.51 19.81,53.19 v23.47,53.19
  Bottom 0.152: v9.91,42.06 8.38,42.06 UC1.18 | v13.56,43.89 v12.5,42.82 | v23.47,53.19 23.93,53.19 24.38,52.73 R12.1
LED_CH1  (via drill 0.3)
  Top 0.152: v18.59,40.39 19.66,39.32 28.65,39.32 v31.24,41.91 | v32,43.59 34.44,43.59 35.05,44.2 35.36,44.2 35.66,43.89 39.78,43.89 41.45,45.57 41.45,46.79 43.43,48.77 43.43,63.7 44.04,64.31 v44.04,71.78
  Bottom 0.152: v18.59,40.39 18.44,40.54 16.76,40.54 UC1.46 | v31.24,41.91 32,42.67 v32,43.59 | v44.04,71.78 44.04,74.22 40.69,77.57 40.69,86.11 42.82,88.24 42.82,97.69 42.22,98.3 38.56,98.3 37.64,97.38 35.51,97.38 34.14,96.01 34.14,95.86 33.98,95.71 32.46,95.71 31.7,96.47 R6.2
LED_CH2  (via drill 0.3)
  Top 0.152: v19.36,40.54 20.12,40.54 21.03,39.62 28.19,39.62 v31.24,42.67 | v32.31,52.43 32.31,54.41 36.73,58.83 36.73,75.13 v37.95,76.35
  Bottom 0.152: v19.36,40.54 18.9,41 16.76,41 UC1.45 | v31.24,42.67 31.24,43.59 32.31,44.65 v32.31,52.43 | v37.95,76.35 37.95,80.01 33.38,84.58 32.61,84.58 31.7,85.5 R7.2
LED_CH3  (via drill 0.3)
  Top 0.152: v15.09,44.81 13.26,46.63 13.26,51.05 v21.49,59.28 | v27.28,65.08 27.28,69.8 31.24,73.76 v31.55,73.76
  Bottom 0.152: v15.09,44.81 15.09,43.28 16.31,42.06 16.61,42.06 UC1.43 | v27.28,65.08 v21.49,59.28 | v31.55,73.76 31.55,75.44 R8.2
LED_CH4
  Bottom 0.152: UC1.42 16.76,42.67 18.44,42.67 23.93,48.16 23.93,51.82 22.86,52.88 22.86,53.19 22.55,53.49 21.34,53.49 21.18,53.65 21.18,57.76 28.19,64.77 28.19,66.6 31.55,69.95 R9.2
LED_FRAME  (via drill 0.3)
  Top 0.152: v17.83,43.43 17.83,53.65 v22.4,58.22 | v37.64,66.45 37.64,66.75 40.69,69.8 v40.69,75.74
  Bottom 0.152: v17.83,43.43 17.53,43.13 16.76,43.13 UC1.41 | v22.4,58.22 22.4,58.52 28.5,64.62 28.5,65.08 29.57,66.14 37.34,66.14 v37.64,66.45 | v40.69,75.74 40.69,77.11 39.47,78.33 39.47,91.44 42.06,94.03 42.06,94.79 41.15,95.71 37.03,95.71 36.27,96.47 R16.1
LED_G  (via drill 0.3)
  Top 0.152: v9.3,41 13.26,37.03 15.54,37.03 v16.15,36.42
  Bottom 0.152: v9.3,41 8.84,41.45 8.38,41.45 UC1.17 | v16.15,36.42 17.53,36.42 17.83,36.73 17.83,37.95 19.36,39.47 19.51,39.47 20.73,40.69 20.73,41.91 26.98,48.16 26.98,52.58 R11.1
LED_R  (via drill 0.3)
  Top 0.152: v7.16,42.06 7.16,41.6 7.62,41.15 7.62,40.84 6.86,40.08 6.71,40.08 6.25,39.62 6.25,31.7 v9.14,28.8 | v18.75,29.26 18.75,35.97 14.48,40.23 13.87,40.23 13.41,39.78 12.65,39.78 12.19,40.23 12.19,40.54 13.26,41.6 20.42,41.6 20.88,42.06 20.88,42.52 20.42,42.98 v20.42,46.18
  Bottom 0.152: v7.16,42.06 7.62,42.52 8.23,42.52 UC1.19 | v9.14,28.8 9.45,28.8 13.41,24.84 15.39,24.84 17.37,26.82 17.37,28.35 18.29,29.26 v18.75,29.26 | v20.42,46.18 21.95,47.7 21.95,52.58 R13.1
MODULATION  (via drill 0.3)
  Top 0.152: v9.6,36.27 10.21,36.27 13.41,33.07 14.94,33.07 v15.7,32.31 18.14,29.87 v18.14,28.35
  Bottom 0.152: v9.6,36.27 9.6,37.03 9.3,37.34 9.3,39.62 8.84,40.08 8.38,40.08 UC1.14 | v15.7,32.31 14.78,31.39 D3.3 | v18.14,28.35 18.14,27.13 R39.2
N$1  (via drill 0.3)
  Top 0.152: v21.03,10.36 24.99,10.36 29.72,15.09 29.72,17.98 40.08,28.35 40.08,36.12 v43.13,39.17 | v42.06,46.33 42.06,46.94 46.18,51.05 46.18,64.01 45.57,64.62 R15.P$3
  Bottom 0.152: 20.42,10.36 20.42,10.21 19.51,9.3 R64.1 | 20.42,10.36 20.42,13.87 20.12,14.17 19.51,14.17 19.2,13.87 19.2,13.56 IC13.2 | v21.03,10.36 20.42,10.36 | v43.13,39.17 43.13,45.26 v42.06,46.33
N$2
  Bottom 0.152: R55.1 5.03,29.72 7.47,29.72 C42.1
N$3  (via drill 0.3)
  Top 0.152: v9.91,103.63 21.03,103.63 32,92.66 32,82.45 33.98,80.47 v36.58,80.47 | v45.41,20.88 40.84,16.31 40.84,15.54 40.08,14.78 33.38,14.78 27.89,9.3 18.29,9.3 14.94,5.94 J7.TIP
  Bottom 0.152: v9.91,103.63 8.53,103.63 R28.2 | v36.58,80.47 36.58,80.16 37.34,79.4 37.34,75.44 47.85,64.92 47.85,51.36 47.55,51.05 47.55,47.85 49.53,45.87 49.53,24.99 v45.41,20.88
N$4
  Bottom 0.152: IC9.7 16.15,98.6 14.17,98.6 13.56,99.21 R32.2 13.41,99.36 11.12,99.36 R53.1
N$5  (via drill 0.3)
  Top 0.152: v23.47,11.12 25.3,11.12 29.41,15.24 29.41,18.75 34.9,24.23 34.9,29.11 39.78,33.98 39.78,37.03 v42.52,39.78 | v41.15,47.24 41.15,62.79 42.98,64.62 R15.P$2
  Bottom 0.152: v23.47,11.12 22.25,9.91 R18.2 | v42.52,39.78 42.52,44.96 41.15,46.33 v41.15,47.24
N$6
  Bottom 0.152: R6.1 33.38,96.62 33.38,99.06 R2.5
N$7
  Bottom 0.152: UC1.5 13.26,37.95 13.26,34.9 12.34,33.98 Q1.X1
N$8
  Bottom 0.152: UC1.6 12.65,37.95 12.65,37.03 9.91,34.29 9.91,33.98 Q1.X2
N$9
  Bottom 0.152: IC13.1 19.66,13.41 19.66,11.12 19.51,10.97 R64.2 19.36,10.82 17.07,10.82 R41.1
N$10
  Bottom 0.152: C27.1 29.57,29.72 31.85,29.72 R35.1
N$11
  Bottom 0.152: R18.1 22.25,8.08 23.16,8.08 24.23,7.01 34.9,7.01 35.97,5.94 J6.TIP
N$12
  Bottom 0.152: R31.1 13.56,78.18 13.72,78.33 16.15,78.33 IC8.6 16.31,78.33 16.76,78.33 19.96,75.13 19.96,66.9 20.42,66.45 IC10.4
N$13
  Bottom 0.152: R39.1 19.81,26.98 19.81,24.84 R40.2 19.81,24.69 19.81,22.55 C31.2 19.81,22.4 19.2,21.79 19.2,19.36 IC13.7
N$14
  Bottom 0.152: 15.85,9.14 16.92,9.14 R41.2 | 15.85,9.14 14.63,9.14 R42.2 | R40.1 18.14,24.69 18.14,22.55 C31.1 18.29,22.4 18.44,22.25 18.44,19.36 IC13.6 18.44,19.2 18.44,17.98 | 15.85,9.14 15.85,15.39 18.44,17.98 | 18.44,17.98 18.75,17.68 19.96,17.68 20.42,18.14 20.42,18.29 24.08,21.95 39.32,21.95 45.87,28.5 45.87,31.09 46.48,31.7 47.55,31.7 49.23,33.38 49.23,45.72 44.96,49.99 44.96,57.76 40.54,62.18 40.54,64.62 R15.P$1
N$15
  Bottom 0.152: R50.2 10.97,78.18 10.52,78.64 10.36,78.64 9.91,79.1 9.91,80.62 10.21,80.92 15.39,80.92 16,80.31 20.42,80.31 21.64,79.1 21.95,79.1 IC8.2 22.1,78.94 23.62,78.94 24.38,78.18 C39.1 24.54,78.18 26.98,78.18 R49.1
N$16
  Bottom 0.152: IC8.1 22.1,79.7 24.38,79.7 C39.2 24.54,79.86 26.98,79.86 R49.2 27.13,79.86 29.41,79.86 R48.1
N$17
  Bottom 0.152: R28.1 8.53,105.31 10.97,105.31 R29.2 11.12,105.31 13.41,105.31 C23.2 13.56,105.31 13.72,105.16 16.15,105.16 IC7.7
N$18
  Bottom 0.152: R34.1 22.1,30.63 24.38,30.63 C22.1
N$19
  Bottom 0.152: IC7.2 22.1,105 23.16,105 24.38,103.78 C38.1 24.54,103.63 26.98,103.63 R43.1 27.13,103.63 28.04,103.63 28.8,102.87 36.12,102.87 | R47.2 36.12,99.06 36.12,101.5 R46.2 36.12,101.65 36.12,102.87 | R44.2 36.12,106.38 36.12,104.09 R45.2 36.12,103.94 36.12,102.87
N$20  (via drill 0.3)
  Top 0.152: v15.24,97.38 15.24,81.84 v18.14,78.94
  Bottom 0.152: 15.24,97.84 13.72,97.84 13.56,97.69 R32.1 | 15.24,97.84 16.15,97.84 IC9.6 | v15.24,97.38 15.24,97.84 | v18.14,78.94 20.42,76.66 20.42,71.78 IC10.13
N$21
  Bottom 0.152: R29.1 11.12,103.63 13.41,103.63 C23.1 13.56,103.78 14.17,104.39 16.15,104.39 IC7.6 16.31,104.55 16.76,104.55 18.44,106.22 30.02,106.22 30.33,105.92 30.33,104.55 29.57,103.78 R30.2
N$22
  Bottom 0.152: R53.2 11.12,97.54 12.19,97.54 12.95,96.77 19.81,96.77 21.49,98.45 21.95,98.45 IC9.2 22.1,98.45 23.62,98.45 24.38,97.69 C40.1 24.54,97.69 26.98,97.69 R52.1
N$23
  Bottom 0.152: IC9.1 22.1,99.21 24.38,99.21 C40.2 24.54,99.36 26.98,99.36 R52.2 27.13,99.36 29.41,99.36 R51.1
N$24  (via drill 0.3)
  Top 0.152: v14.63,90.83 14.63,77.27 v15.54,76.35
  Bottom 0.152: 14.63,91.29 13.56,91.29 R37.1 | 14.63,91.29 16.15,91.29 IC11.6 | v14.63,90.83 14.63,91.29 | v15.54,76.35 19.2,72.69 19.2,71.78 IC10.12
N$25
  Bottom 0.152: R16.2 37.95,96.62 41.15,96.62 41.76,97.23 LED6.A
N$26
  Bottom 0.152: R60.2 11.12,91.14 12.04,91.14 12.95,90.22 19.81,90.22 21.64,92.05 21.95,92.05 IC11.2 22.1,92.05 23.62,92.05 24.38,91.29 C44.1 24.54,91.14 26.98,91.14 R59.1
N$27
  Bottom 0.152: IC11.1 22.1,92.81 24.38,92.81 C44.2 24.54,92.81 26.98,92.81 R59.2 27.13,92.81 29.41,92.81 R58.1
N$28
  Bottom 0.152: C43.1 42.52,29.11 44.96,29.11 R56.1
N$29
  Bottom 0.152: R30.1 29.41,105.31 27.13,105.31 R43.2 26.98,105.31 24.54,105.31 C38.2 24.38,105.46 24.23,105.61 22.1,105.61 IC7.1
N$30
  Bottom 0.152: IC12.6 16.15,84.89 13.72,84.89 13.56,84.73 R38.1 13.41,84.73 12.5,84.73 11.73,85.5 10.36,85.5 8.23,83.36 8.23,77.72 10.97,74.98 16.46,74.98 18.59,72.85 18.59,68.12 19.2,67.51 19.2,66.45 IC10.5
N$31
  Bottom 0.152: 31.85,35.36 30.33,35.36 IC6.3 | 31.85,35.36 32.61,34.59 R27.1 | 31.85,35.36 32.61,36.12 32.61,36.88 R65.2
N$32
  Bottom 0.152: R63.2 11.12,84.58 12.19,84.58 12.95,83.82 17.98,83.82 19.66,85.5 21.95,85.5 IC12.2 22.1,85.5 23.62,85.5 24.38,84.73 C46.1 24.54,84.73 26.98,84.73 R62.1
N$33
  Bottom 0.152: IC12.1 22.1,86.26 24.38,86.26 C46.2 24.54,86.41 26.98,86.41 R62.2 27.13,86.41 29.41,86.41 R61.1
N$34
  Top 0.152: J1.NORM 10.82,5.94 13.41,5.94 21.03,13.56 23.62,13.56 28.35,18.29 28.5,18.29 34.59,24.38 34.59,29.26 39.47,34.14 39.47,37.49 44.81,42.82 45.87,42.82 S1.2
N$35
  Bottom 0.152: R13.2 22.1,54.41 22.1,56.08 22.55,56.54 LED5.RED
N$36
  Bottom 0.152: R12.2 24.54,54.41 24.54,55.93 25.15,56.54 LED5.BLU
N$37
  Bottom 0.152: R11.2 26.98,54.41 26.98,56.08 26.52,56.54 LED5.GRN
N$38
  Bottom 0.152: R7.1 33.38,85.65 33.38,88.54 R3.5
N$39
  Bottom 0.152: IC3.2 11.12,55.32 11.12,56.24 7.47,59.89 R19.1
N$40  (via drill 0.3)
  Top 0.152: v31.7,72.54 31.7,70.71 34.9,67.51 v34.9,58.22 | v35.97,57.15 35.97,56.69 35.81,56.54 v35.81,44.5 | v35.81,38.71 35.81,32 32.46,28.65 32.46,22.71 28.35,18.59 27.58,18.59 22.86,13.87 4.42,13.87 2.44,15.85 J8.TIP
  Bottom 0.152: v31.7,72.54 29.57,74.68 29.57,78.03 R48.2 | v35.97,57.15 v34.9,58.22 | v35.81,38.71 v35.81,44.5
N$41
  Bottom 0.152: IC3.3 11.58,55.32 11.58,59.74 11.43,59.89 R20.1
N$42
  Top 0.152: S1.3 45.87,40.23 45.87,34.75 45.26,34.14 JP1.2
N$43
  Bottom 0.152: IC3.4 12.19,55.32 12.19,56.69 15.39,59.89 R21.1
N$44
  Bottom 0.152: 43.59,6.25 44.96,6.25 R25.1 45.11,6.1 47.85,6.1 48.01,5.94 J12.TIP | 43.59,6.25 42.52,6.25 R24.2 | 43.59,6.25 43.59,3.96 Q2.C
N$45  (via drill 0.3)
  Top 0.152: v17.98,58.98 v13.41,54.41
  Bottom 0.152: v13.41,54.41 12.65,55.17 IC3.5 | v17.98,58.98 18.29,58.98 19.2,59.89 R22.1
N$46
  Bottom 0.152: R8.1 33.38,75.59 33.38,77.88 R4.5
N$47
  Bottom 0.152: R23.2 46.94,1.68 44.5,1.68 Q2.B
N$48
  Bottom 0.152: IC12.7 16.15,85.65 14.17,85.65 13.56,86.26 R38.2 13.41,86.41 11.12,86.41 R63.1
N$49  (via drill 0.3)
  Top 0.152: v27.89,96.01 27.89,73.76 v25.6,71.48 | v23.77,63.09 23.77,61.27 27.89,57.15 27.89,48.92 27.58,48.62 27.58,45.11 v28.8,43.89 | v28.04,37.49 28.04,29.11 v25.45,26.52 | v20.42,19.51 18.44,19.51 14.94,16 J9.TIP
  Bottom 0.152: v27.89,96.01 29.41,97.54 R51.2 | v25.6,71.48 25.6,64.92 v23.77,63.09 | v28.8,43.89 28.8,43.43 28.5,43.13 28.5,37.95 v28.04,37.49 | v25.45,26.52 25.45,24.54 v20.42,19.51
N$50  (via drill 0.3)
  Top 0.152: v36.42,77.72 43.89,77.72 49.53,72.08 49.53,49.38 v49.38,49.23 | v48.16,48.01 48.16,36.27 46.48,34.59 46.48,33.68 44.35,31.55 43.74,31.55 43.28,31.09 43.28,28.5 48.01,23.77 48.01,16 J11.TIP
  Bottom 0.152: v36.42,77.72 29.57,84.58 R61.2 | v48.16,48.01 v49.38,49.23
N$51  (via drill 0.3)
  Top 0.152: v29.41,88.85 29.41,73.15 v29.11,72.85 | v30.33,71.63 30.33,61.72 31.7,60.35 31.7,49.38 v35.2,45.87 | v41.76,35.66 41.76,35.36 40.84,34.44 40.84,20.73 36.12,16 J10.TIP
  Bottom 0.152: v29.41,88.85 29.41,91.14 R58.2 | v30.33,71.63 v29.11,72.85 | v35.2,45.87 41.76,39.32 v41.76,35.66
N$52
  Bottom 0.152: R9.1 33.38,69.95 33.38,67.51 R5.5
N$56
  Top 0.152: JP2.2 37.34,55.78 39.78,55.78 JP2.1
  Bottom 0.152: P1.2 43.28,56.39 40.54,56.39 39.93,55.78 JP2.1
N$64
  Top 0.152: JP2.9 39.78,45.72 37.34,45.72 JP2.10
  Bottom 0.152: P2.2 33.83,45.11 33.83,46.02 35.05,47.24 35.66,47.24 37.19,45.72 JP2.10
PAN
  Top 0.152: J4.NORM 23.47,25.91 J3.NORM 23.32,25.91 22.55,25.91 21.18,24.54 12.19,24.54 J2.NORM
  Bottom 0.152: J5.NORM 39.62,25.91 37.64,25.91 36.58,24.84 35.05,24.84 33.68,26.21 27.89,26.21 27.74,26.06 J4.NORM | J1.TIP 2.44,5.94 2.44,7.32 6.4,11.28 6.4,13.87 10.52,17.98 10.52,25.76 10.67,25.91 J2.NORM
POT_CH1  (via drill 0.3)
  Top 0.152: v9.3,45.11 9.3,49.38 6.4,52.27 v6.4,56.84
  Bottom 0.152: v9.3,45.11 9.6,45.11 11.12,43.59 11.12,42.52 10.82,42.22 10.82,38.1 UC1.10 | v6.4,56.84 0.76,62.48 0.76,104.09 3.2,106.53 R2.1
POT_CH2  (via drill 0.3)
  Top 0.152: v26.21,55.47 26.52,55.47 27.28,56.24 27.28,56.84 20.57,63.55 v19.81,63.55 | v18.29,64.77 9.45,73.61 9.45,89.92 3.35,96.01 R3.1
  Bottom 0.152: v26.21,55.47 26.21,48.92 19.66,42.37 19.66,42.06 19.96,41.76 19.96,40.39 19.36,39.78 17.98,39.78 14.78,36.58 14.78,34.75 11.58,31.55 10.52,31.55 9.3,32.77 9.3,34.9 10.21,35.81 10.21,37.95 UC1.11 | v19.81,63.55 19.51,63.55 v18.29,64.77
POT_CH3  (via drill 0.3)
  Top 0.152: v10.52,42.67 4.42,48.77 1.22,48.77 0.46,49.53 0.46,82.6 v1.37,83.52
  Bottom 0.152: v10.52,42.67 10.52,41.45 9.75,40.69 9.75,38.1 UC1.12 | v1.37,83.52 3.2,85.34 R4.1
POT_CH4  (via drill 0.3)
  Top 0.152: v8.99,36.88 10.06,36.88 11.43,35.51 16,35.51 16.76,36.27 16.76,37.19 v14.33,39.62 | v11.89,44.35 11.89,51.36 v16,55.47 | v12.65,60.96 v14.94,58.67 | v12.8,66.45 11.73,66.45 3.35,74.83 R5.1
  Bottom 0.152: v8.99,36.88 8.99,37.34 8.38,37.95 8.38,39.47 UC1.13 | v14.33,39.62 14.33,40.23 11.89,42.67 v11.89,44.35 | v16,55.47 16,57.61 v14.94,58.67 | v12.65,60.96 12.65,66.29 v12.8,66.45
POT_FRAME
  Bottom 0.152: UC1.15 8.23,40.54 7.77,40.54 7.47,40.23 7.47,38.41 8.38,37.49 8.38,33.22 10.36,31.24 12.19,31.24 17.07,36.12 19.66,36.12 24.38,40.84 R14.P$2
RESET  (via drill 0.3)
  Top 0.152: v12.34,39.17 11.89,39.17 v5.03,46.02
  Bottom 0.152: v12.34,39.17 12.34,38.1 UC1.7 | v5.03,46.02 3.05,46.02 1.68,47.4 R1.1 1.68,47.55 1.68,49.99 JP4.10
VCA0_1
  Bottom 0.152: IC8.7 16.15,79.1 14.17,79.1 13.56,79.7 R31.2 13.41,79.86 11.12,79.86 R50.1
VCA0_3
  Bottom 0.152: IC11.7 16.15,92.2 14.17,92.2 13.56,92.81 R37.2 13.41,92.81 11.12,92.81 R60.1
VCA_1  (via drill 0.3)
  Top 0.152: v44.04,86.11 35.51,77.57 35.51,58.06 34.59,57.15 v34.29,57.15 | v34.29,52.58 34.29,47.55 v35.2,46.63 | v33.83,38.71 33.83,33.98 v30.48,30.63
  Bottom 0.152: v44.04,86.11 44.04,94.94 45.26,96.16 45.26,97.99 37.95,105.31 37.95,106.38 R44.1 | v34.29,52.58 v34.29,57.15 | v35.2,46.63 34.59,46.02 34.59,43.43 34.75,43.28 34.75,39.62 v33.83,38.71 | v30.48,30.63 30.18,30.63 30.02,30.48 25.76,30.48 24.84,29.57 20.57,29.57 18.9,27.89 18.9,26.36 18.14,25.6 17.53,25.6 10.82,18.9 10.82,16 J8.NORM
VCA_2  (via drill 0.3)
  Top 0.152: v47.7,68.12 47.7,51.05 40.23,43.59 v35.2,43.59 | v35.2,39.32 35.2,32.77 29.72,27.28 29.72,22.25 30.33,21.64 30.33,21.03 28.19,18.9 26.98,18.9 24.08,16 23.47,16 J9.NORM
  Bottom 0.152: v47.7,68.12 49.23,69.65 49.23,79.25 43.43,85.04 43.43,97.54 42.06,98.91 37.95,98.91 R47.1 | v35.2,39.32 v35.2,43.59
VCA_3  (via drill 0.3)
  Top 0.152: v39.32,100.13 39.32,87.02 v41.3,85.04 | v48.92,66.14 48.92,65.84 49.23,65.53 49.23,49.84 48.77,49.38 48.77,34.75 48.92,34.59 v48.92,30.79 | v40.08,21.95 27.89,9.75 20.88,9.75 20.42,10.21 20.42,10.52 23.16,13.26 24.23,13.26 26.82,15.85 27.58,15.85 J10.NORM
  Bottom 0.152: v39.32,100.13 37.95,101.5 R46.1 | v41.3,85.04 41.3,77.42 45.57,73.15 45.57,69.49 v48.92,66.14 | v48.92,30.79 48.16,30.02 46.94,30.02 46.18,29.26 46.18,28.04 v40.08,21.95
VCA_4  (via drill 0.3)
  Top 0.152: v37.95,81.69 v37.95,102.56 | v39.17,74.37 39.17,73.61 40.39,72.39 40.39,69.95 37.03,66.6 37.03,57.3 36.12,56.39 36.12,47.55 36.88,46.79 v38.1,46.79 | v42.37,36.27 42.37,35.51 41.15,34.29 41.15,17.37 39.78,16 J11.NORM
  Bottom 0.152: v37.95,102.56 37.95,103.94 R45.1 | v37.95,81.69 37.95,80.47 39.17,79.25 v39.17,74.37 | v38.1,46.79 38.1,46.48 38.56,46.02 38.56,42.98 42.37,39.17 v42.37,36.27
VCC  (via drill 0.3)
  Top 0.152: v21.95,16.46 20.12,18.29 v19.81,18.29 18.75,18.29 14.94,14.48 v4.57,14.48 | v45.57,53.03 44.96,53.03 v44.04,52.12 | v16.76,100.43 16.15,100.43 v15.7,99.97 14.02,98.3 v14.02,93.88 v14.02,87.33 14.02,75.13 15.39,73.76 15.85,73.76 19.2,77.11 | v25.15,72.24 24.08,72.24 19.2,77.11 | v18.59,77.72 19.2,77.11 | v29.41,64.77 29.41,69.34 v28.5,70.26 | v20.73,35.36 v20.73,28.96
  Bottom 0.152: v19.81,18.29 19.81,19.2 IC13.8 19.81,19.36 19.81,21.03 20.73,21.95 v20.73,28.96 | C34.1 21.95,13.41 v21.95,16.46 21.95,16.92 24.23,19.2 25.15,19.2 25.76,18.59 29.26,18.59 IC4.3 | R25.2 44.96,7.77 43.89,7.77 43.13,7.01 41.91,7.01 41.6,6.71 41.6,4.12 43.13,2.59 43.28,2.59 43.43,2.44 43.43,0.91 43.13,0.61 8.23,0.61 5.49,3.35 5.49,4.12 4.88,4.72 1.83,4.72 1.22,5.33 1.22,8.38 3.81,10.97 C11.+ 3.96,11.12 4.27,11.43 4.27,14.48 | 4.27,14.48 4.27,18.44 IC1.3 | 4.27,14.48 v4.57,14.48 | P1.1 46.33,56.39 46.79,55.93 46.79,53.19 D1.C 46.79,53.03 v45.57,53.03 | 30.63,54.86 27.58,51.82 27.58,47.24 28.19,46.63 28.19,39.93 24.99,36.73 24.69,36.73 IC6.8 24.54,36.73 22.25,36.73 R26.1 22.1,36.73 v20.73,35.36 | 30.63,54.86 30.63,58.83 C4.+ 30.63,58.98 30.63,61.27 29.41,62.48 v29.41,64.77 | v44.04,52.12 40.39,52.12 40.23,51.97 33.53,51.97 30.63,54.86 | 15.7,106.22 7.92,106.22 7.62,105.92 7.62,104.24 3.81,100.43 2.74,100.43 1.98,99.67 1.98,88.09 2.74,87.33 v14.02,87.33 15.09,86.26 16.15,86.26 IC12.8 | 15.7,106.22 16.15,105.77 IC7.8 | 15.7,106.22 16.31,106.83 16.31,107.44 C29.1 | 14.02,93.73 14.94,92.81 16.15,92.81 IC11.8 | 14.02,93.73 10.36,93.73 10.21,93.57 10.21,90.53 11.43,89.31 15.54,89.31 16.31,88.54 C24.1 | 15.7,99.36 14.94,99.36 14.17,100.13 10.36,100.13 10.21,99.97 10.21,96.93 11.28,95.86 15.54,95.86 16.31,95.1 C35.1 | 15.7,99.36 16.15,99.36 IC9.8 | v16.76,100.43 16.46,100.74 16.46,101.5 C30.1 | 15.7,99.36 v15.7,99.97 | v14.02,93.88 14.02,93.73 | IC10.16 24.38,71.78 24.84,72.24 v25.15,72.24 26.36,72.24 C25.1 26.52,72.24 v28.5,70.26 | C26.1 16.31,82.14 15.54,82.91 11.73,82.91 9.6,80.77 9.6,78.03 10.21,77.42 11.73,77.42 11.89,77.57 11.89,78.64 11.58,78.94 10.52,78.94 10.21,79.25 10.21,80.47 10.36,80.62 14.17,80.62 14.94,79.86 16.15,79.86 IC8.8 16.31,79.7 16.61,79.7 v18.59,77.72
VEE  (via drill 0.3)
  Top 0.152: v29.41,39.17 v29.41,35.36 29.41,22.1 30.02,21.49 30.02,21.18 28.35,19.51 v26.82,19.51 | v22.1,99.97 22.1,82.45 v21.03,81.38 v21.03,78.33 18.44,78.33 15.54,75.44 v15.54,74.37 | v30.94,53.8 30.94,60.66 v22.86,68.73
  Bottom 0.152: v29.41,35.36 29.87,34.9 30.18,34.9 IC6.4 | v29.41,39.17 29.41,41.76 29.87,42.22 D2.A 30.02,42.37 30.94,43.28 30.94,44.96 P2.1 30.94,45.11 v30.94,53.8 | 17.83,8.38 17.83,4.42 16.92,3.5 C21.- | 17.83,8.38 17.83,9.75 17.68,9.91 16.46,9.91 16.15,10.21 16.15,11.43 17.83,13.11 17.83,13.41 IC13.4 17.98,13.56 17.98,14.02 23.47,19.51 v26.82,19.51 | 17.83,8.38 13.87,8.38 13.72,8.53 13.72,9.75 14.48,10.52 14.48,10.82 R42.1 14.48,10.97 13.72,11.73 13.72,16.46 15.39,18.14 C48.2 | 14.78,71.02 15.39,71.63 IC10.9 15.54,71.78 v15.54,74.37 | 14.78,71.02 13.72,69.95 13.11,69.95 C36.2 | 14.78,71.02 11.12,74.68 10.82,74.68 6.25,79.25 2.74,79.25 1.98,78.49 1.98,71.93 2.74,71.17 3.81,71.17 5.03,69.95 10.21,69.95 U$1.A | 22.1,95.86 22.1,95.1 C47.2 | 22.1,95.86 22.1,97.23 IC9.4 | 24.69,89.15 23.16,90.68 22.1,90.68 IC11.4 | 24.69,89.15 24.69,87.94 24.38,87.63 23.01,87.63 22.25,88.39 C41.2 | 22.1,95.86 25.91,95.86 28.04,93.73 30.02,93.73 30.33,93.42 30.33,92.2 30.02,91.9 28.8,91.9 27.89,90.98 27.89,90.53 27.43,90.07 | 27.43,90.07 26.52,89.15 24.69,89.15 | IC7.4 22.1,103.63 22.1,101.65 C45.2 22.1,101.5 v22.1,99.97 | 22.1,83.82 22.1,82.14 C28.2 22.1,81.99 21.49,81.38 v21.03,81.38 | 22.1,83.82 22.1,84.12 IC12.4 | v21.03,78.33 21.49,77.88 21.95,77.88 IC8.4 22.1,77.72 22.1,75.59 C37.2 22.25,75.44 22.4,75.29 22.4,70.41 22.86,69.95 v22.86,68.73 | 27.43,90.07 30.33,87.17 30.33,85.8 30.02,85.5 28.96,85.5 27.89,84.43 27.89,84.12 27.58,83.82 22.1,83.82

## Text on the board
bPlace: Original design by Olivier Gillet | 2019 - V3.1 | Mod by Codex Modulex | CC-BY-SA-3.0
bNames: µSlices